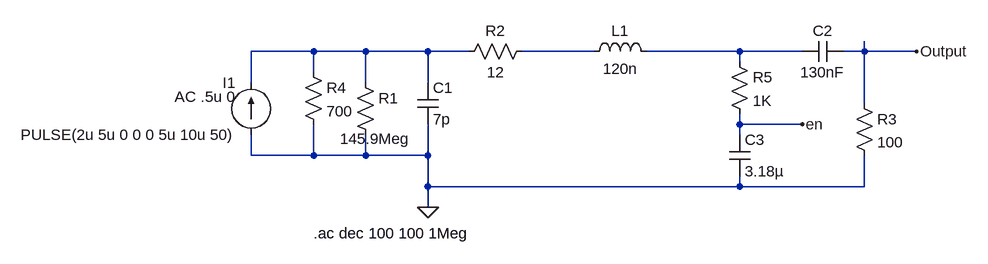
[diagram p0: schematic Draft2.asc]
Draft2.asc, the LTspice schematic file:
Version 4
SHEET 1 1176 680
WIRE 160 192 64 192
WIRE 240 192 160 192
WIRE 336 192 240 192
WIRE 400 192 336 192
WIRE 592 192 480 192
WIRE 816 192 672 192
WIRE 912 192 816 192
WIRE 1008 192 1008 176
WIRE 1008 192 976 192
WIRE 1088 192 1008 192
WIRE 816 208 816 192
WIRE 160 224 160 192
WIRE 64 240 64 192
WIRE 240 240 240 192
WIRE 336 240 336 192
WIRE 1008 272 1008 192
WIRE 816 304 816 288
WIRE 912 304 816 304
WIRE 816 320 816 304
WIRE 64 352 64 320
WIRE 160 352 160 304
WIRE 160 352 64 352
WIRE 240 352 240 320
WIRE 240 352 160 352
WIRE 336 352 336 304
WIRE 336 352 240 352
WIRE 336 400 336 352
WIRE 816 400 816 384
WIRE 816 400 336 400
WIRE 1008 400 1008 352
WIRE 1008 400 816 400
WIRE 336 432 336 400
FLAG 336 432 0
FLAG 1088 192 Output
FLAG 912 304 en
SYMBOL res 224 224 R0
WINDOW 3 -23 102 Left 2
SYMATTR InstName R1
SYMATTR Value 145.9Meg
SYMBOL cap 320 240 R0
SYMATTR InstName C1
SYMATTR Value 7p
SYMBOL res 496 176 R90
WINDOW 0 0 56 VBottom 2
WINDOW 3 32 56 VTop 2
SYMATTR InstName R2
SYMATTR Value 12
SYMBOL current 64 320 R180
WINDOW 3 24 0 Left 2
WINDOW 0 24 80 Left 2
WINDOW 123 24 58 Left 2
SYMATTR Value PULSE(2u 5u 0 0 0 5u 10u 50)
SYMATTR InstName I1
SYMATTR Value2 AC .5u 0
SYMBOL Cap 976 176 R90
WINDOW 0 0 32 VBottom 2
WINDOW 3 32 32 VTop 2
SYMATTR InstName C2
SYMATTR Value 130nF
SYMBOL ind 576 208 R270
WINDOW 0 32 56 VTop 2
WINDOW 3 5 56 VBottom 2
SYMATTR InstName L1
SYMATTR Value 120n
SYMBOL Res 992 256 R0
SYMATTR InstName R3
SYMATTR Value 100
SYMBOL res 144 208 R0
SYMATTR InstName R4
SYMATTR Value 700
SYMBOL Res 800 192 R0
SYMATTR InstName R5
SYMATTR Value 1K
SYMBOL Cap 800 320 R0
SYMATTR InstName C3
SYMATTR Value 3.18µ
TEXT 160 472 Left 2 !.ac dec 100 100 1Meg

The netlist it stands for:
* Draft2.asc
R1 N001 0 145.9Meg
C1 N001 0 7p
R2 N002 N001 12
I1 0 N001 PULSE(2u 5u 0 0 0 5u 10u 50) AC .5u 0
C2 Output N003 130nF
L1 N002 N003 120n
R3 Output 0 100
R4 N001 0 700
R5 N003 en 1K
C3 en 0 3.18µ
.ac dec 100 100 1Meg
.backanno
.end